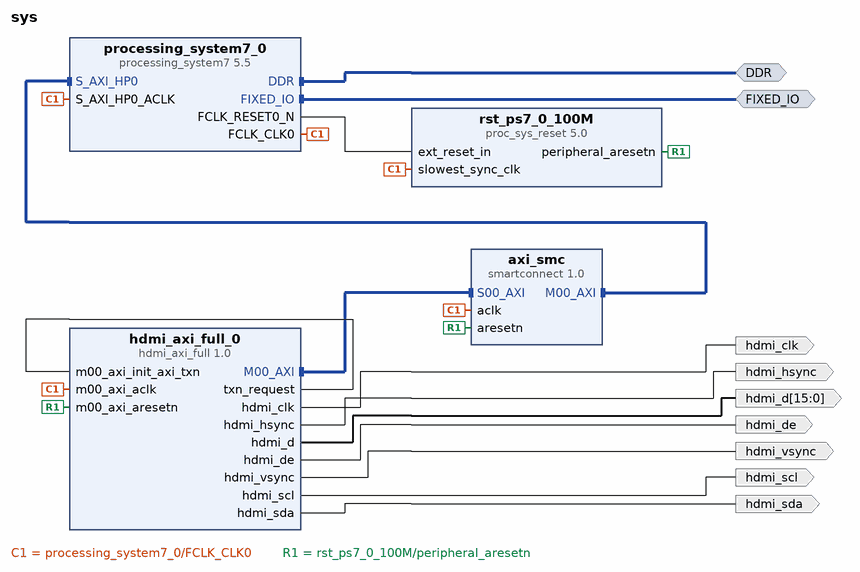
[diagram p0: block diagram of the top level]
# Vivado block design sys, xc7z020clg484-1, Vivado 2019.1
create_bd_design sys

create_bd_intf_port -mode Master -vlnv xilinx.com:interface:ddrx_rtl:1.0 DDR
create_bd_intf_port -mode Master -vlnv xilinx.com:display_processing_system7:fixedio_rtl:1.0 FIXED_IO
create_bd_port -dir O -type clk hdmi_clk
create_bd_port -dir O -type data hdmi_hsync
create_bd_port -dir O -type data hdmi_vsync
create_bd_port -dir O -type data hdmi_de
create_bd_port -dir O -from 15 -to 0 -type data hdmi_d
create_bd_port -dir O -type clk hdmi_scl
create_bd_port -dir O -type data hdmi_sda

create_bd_cell -type ip -vlnv xilinx.com:ip:processing_system7:5.5 processing_system7_0
set_property -dict [list \
  CONFIG.PCW_APU_PERIPHERAL_FREQMHZ 666.666667 \
  CONFIG.PCW_ENET0_PERIPHERAL_ENABLE 0 \
  CONFIG.PCW_FPGA0_PERIPHERAL_FREQMHZ 100.000000 \
  CONFIG.PCW_FPGA1_PERIPHERAL_FREQMHZ 150.000000 \
  CONFIG.PCW_FPGA2_PERIPHERAL_FREQMHZ 50.000000 \
  CONFIG.PCW_GPIO_MIO_GPIO_ENABLE 0 \
  CONFIG.PCW_PRESET_BANK1_VOLTAGE {LVCMOS 1.8V} \
  CONFIG.PCW_QSPI_GRP_SINGLE_SS_ENABLE 1 \
  CONFIG.PCW_QSPI_GRP_SINGLE_SS_IO {MIO 1 .. 6} \
  CONFIG.PCW_QSPI_PERIPHERAL_ENABLE 1 \
  CONFIG.PCW_QSPI_PERIPHERAL_FREQMHZ 200.000000 \
  CONFIG.PCW_QSPI_QSPI_IO {MIO 1 .. 6} \
  CONFIG.PCW_SD0_PERIPHERAL_ENABLE 0 \
  CONFIG.PCW_SDIO_PERIPHERAL_FREQMHZ 50 \
  CONFIG.PCW_SINGLE_QSPI_DATA_MODE x4 \
  CONFIG.PCW_UART1_PERIPHERAL_ENABLE 1 \
  CONFIG.PCW_UART1_UART1_IO {MIO 48 .. 49} \
  CONFIG.PCW_UART_PERIPHERAL_FREQMHZ 50 \
  CONFIG.PCW_UIPARAM_DDR_FREQ_MHZ 533.333313 \
  CONFIG.PCW_UIPARAM_DDR_PARTNO {MT41J128M16 HA-15E} \
  CONFIG.PCW_USB0_PERIPHERAL_ENABLE 0 \
  CONFIG.PCW_USE_M_AXI_GP0 0 \
  CONFIG.PCW_USE_S_AXI_HP0 1 \
  CONFIG.preset ZedBoard \
] [get_bd_cells processing_system7_0]
# 84 more settings of processing_system7_0 are not shown: defaults, MIO pin electricals, DDR timing, and values the tool derives
create_bd_cell -type ip -vlnv xilinx.com:ip:smartconnect:1.0 axi_smc
set_property -dict {CONFIG.NUM_SI 1} [get_bd_cells axi_smc]
create_bd_cell -type ip -vlnv xilinx.com:ip:proc_sys_reset:5.0 rst_ps7_0_100M
create_bd_cell -type ip -vlnv xilinx.com:user:hdmi_axi_full:1.0 hdmi_axi_full_0
set_property -dict {CONFIG.C_M00_AXI_TARGET_SLAVE_BASE_ADDR 0x10000000} [get_bd_cells hdmi_axi_full_0]

# ---- connections ----

connect_bd_intf_net [get_bd_intf_ports FIXED_IO] [get_bd_intf_pins processing_system7_0/FIXED_IO]
connect_bd_intf_net [get_bd_intf_pins hdmi_axi_full_0/M00_AXI] [get_bd_intf_pins axi_smc/S00_AXI]
connect_bd_intf_net [get_bd_intf_ports DDR] [get_bd_intf_pins processing_system7_0/DDR]
connect_bd_intf_net [get_bd_intf_pins axi_smc/M00_AXI] [get_bd_intf_pins processing_system7_0/S_AXI_HP0]
connect_bd_net [get_bd_pins processing_system7_0/FCLK_CLK0] \
  [get_bd_pins axi_smc/aclk] [get_bd_pins rst_ps7_0_100M/slowest_sync_clk] [get_bd_pins processing_system7_0/S_AXI_HP0_ACLK] \
  [get_bd_pins hdmi_axi_full_0/m00_axi_aclk]
connect_bd_net [get_bd_pins processing_system7_0/FCLK_RESET0_N] [get_bd_pins rst_ps7_0_100M/ext_reset_in]
connect_bd_net [get_bd_pins rst_ps7_0_100M/peripheral_aresetn] [get_bd_pins axi_smc/aresetn] [get_bd_pins hdmi_axi_full_0/m00_axi_aresetn]
connect_bd_net [get_bd_pins hdmi_axi_full_0/txn_request] [get_bd_pins hdmi_axi_full_0/m00_axi_init_axi_txn]
connect_bd_net [get_bd_pins hdmi_axi_full_0/hdmi_clk] [get_bd_ports hdmi_clk]
connect_bd_net [get_bd_pins hdmi_axi_full_0/hdmi_hsync] [get_bd_ports hdmi_hsync]
connect_bd_net [get_bd_pins hdmi_axi_full_0/hdmi_vsync] [get_bd_ports hdmi_vsync]
connect_bd_net [get_bd_pins hdmi_axi_full_0/hdmi_de] [get_bd_ports hdmi_de]
connect_bd_net [get_bd_pins hdmi_axi_full_0/hdmi_d] [get_bd_ports hdmi_d]
connect_bd_net [get_bd_pins hdmi_axi_full_0/hdmi_scl] [get_bd_ports hdmi_scl]
connect_bd_net [get_bd_pins hdmi_axi_full_0/hdmi_sda] [get_bd_ports hdmi_sda]

# ---- address map ----
assign_bd_address -offset 0x10000000 -range 256M -target_address_space [get_bd_addr_spaces hdmi_axi_full_0/M00_AXI] [get_bd_addr_segs processing_system7_0/S_AXI_HP0/HP0_DDR_LOWOCM]

validate_bd_design
save_bd_design
